# Altium project WB-AV-4510-CAN.PrjPcb (part 2 of 2)

## Sheet Temp_Sensor.SchDoc
size A4
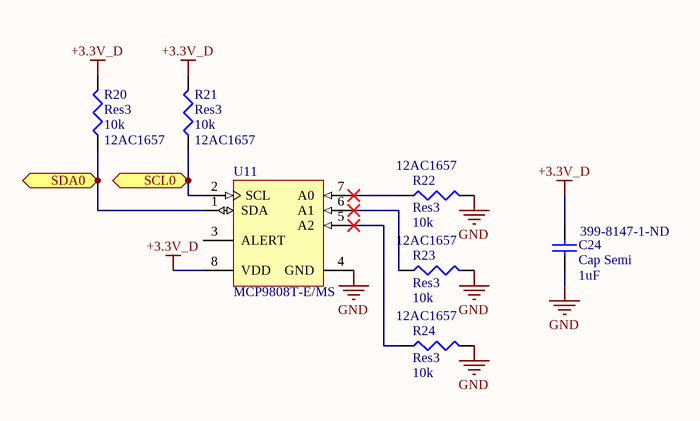
[diagram p4: Temp_Sensor.SchDoc]

### Parts
C24  Cap Semi  value 1uF  Supplier Part Number 1: 399-8147-1-ND  [C1206]
R20  Res3  value 10k  Supplier Part Number 1: 12AC1657  [6-0805_L]
R21  Res3  value 10k  Supplier Part Number 1: 12AC1657  [6-0805_L]
R22  Res3  value 10k  Supplier Part Number 1: 12AC1657  [6-0805_L]
R23  Res3  value 10k  Supplier Part Number 1: 12AC1657  [6-0805_L]
R24  Res3  value 10k  Supplier Part Number 1: 12AC1657  [6-0805_L]
U11  MCP9808T-E/MS  [MCHP-MSOP-MS8_M]

### Ports
SCL0 (bidir), SDA0 (bidir)

### Nets
+3.3V_D: C24.2 R20.2 R21.2 U11.8(VDD)
GND: C24.1 R22.2 R23.2 R24.2 U11.4(GND)  [project net AGND]
NetR20_1: R20.1 U11.1(SDA) ; port SDA0
NetR21_1: R21.1 U11.2(SCL) ; port SCL0
NetR22_1: R22.1 U11.7(A0)
NetR23_1: R23.1 U11.6(A1)
NetR24_1: R24.1 U11.5(A2)

Not connected (* = marked no-connect by the designer): U11 3(ALERT)

### Library data of the parts
C24 = Cap Semi: Multilayer Ceramic Capacitors MLCC - SMD/SMT 50volts 1uF X7R 10%; Manufacturer: KEMET; Manufacturer Part Number: C1206C105K5RACTU; SPN: 732-7692-1-ND; Voltage Rating (DC): 50V; Published: 8-Jun-2000; LatestRevisionDate: 29-May-2009; LatestRevisionNote: IPC-7351 Footprint Added.; PackageReference: C1206; Publisher: Altium Limited; PackageDescription: Chip Capacitor; Supplier 1: Digi-Key; RoHS: Yes; Category: Ceramic Capacitors; Stock 1: 155925; Pricing 1: 1=0.30000, 10=0.20900, 50=0.13940, 100=0.11850, 500=0.08364, 1000=0.07318 (USD); Mount: Surface Mount; Case/Package: 1206; Number of Pins: 2; Case Code (Imperial): 1206; Case Code (Metric): 3216; Dielectric Material: Ceramic; Min Operating Temperature: -55°C; Max Operating Temperature: 125°C; Capacitance: 1uF; Tolerance: 10%; Packaging: Tape and Reel; Dielectric: X7R; Voltage Rating: 50V; Termination: SMD/SMT; Package Quantity: 1; Voltage: 50V; Length: 3.2mm; Height: 1mm; Width: 0.063inch; Depth: 1.6mm; Thickness: 0.043inch; Radiation Hardening: No; REACH SVHC: No SVHC; ComponentLink1URL: https://datasheet.ciiva.com/7730/kem-c1002-x7r-smd-7730086.pdf?src-supplier=Element14; ComponentLink1Description: https://datasheet.ciiva.com/7730/kem-c1002-x7r-smd-7730086.pdf?src-supplier=Element14; ComponentLink2URL: https://datasheet.ciiva.com/6074/kem-c1002-x7r-smd-6074697.pdf?src-supplier=Farnell; ComponentLink2Description: https://datasheet.ciiva.com/6074/kem-c1002-x7r-smd-6074697.pdf?src-supplier=Farnell; ComponentLink3URL: https://datasheet.ciiva.com/22749/1918693-22749725.pdf?src-supplier=Element14; ComponentLink3Description: https://datasheet.ciiva.com/22749/1918693-22749725.pdf?src-supplier=Element14
R20-R24 = Res3: VISHAY BC COMPONENTS   MCT06030C1002FP500   RESISTOR, 0603, 10KOHM, 100mW, 1PER; SPN: RNCP0805FTD10K0CT-ND; Resistance: 10kR; Tolerance: 1%; Temperature Coefficient: 50ppm/°C; Voltage Rating: 75V; Max Power Dissipation: 125mW; Published: 8-Jun-2000; LatestRevisionDate: 29-May-2009; LatestRevisionNote: IPC-7351 Footprint Added.; PackageReference: J1-0603; Publisher: Altium Limited; PackageDescription: Chip Resistor; Supplier 1: Newark; Manufacturer: Vishay; Manufacturer Part Number: MCT06030C1002FP500; RoHS: Yes; Category: Chip SMD Resistors; Stock 1: 224988; Pricing 1: 1=0.02000, 5000=0.01900, 10000=0.01800, 20000=0.01700, 30000=0.01600 (USD); Mount: Surface Mount; Case/Package: 0603; Case Code (Imperial): 0603; Case Code (Metric): 1608; Contact Plating: Tin; Min Operating Temperature: -55°C; Max Operating Temperature: 125°C; Packaging: Tape and Reel; Composition: Thin Film; Power Rating: 100mW; Number of Terminations: 2; Military Standard: Not; Package Quantity: 1; Voltage Rating (DC): 75V; Length: 1.55mm; Height: 0.022inch; Width: 0.8mm; Depth: 0.85mm; Radiation Hardening: No; Lead Free: Lead Free; REACH SVHC: Unknown; ComponentLink1URL: https://datasheet.ciiva.com/7836/mc-pro-7836231.pdf?src-supplier=Element14; ComponentLink1Description: https://datasheet.ciiva.com/7836/mc-pro-7836231.pdf?src-supplier=Element14; ComponentLink2URL: https://datasheet.ciiva.com/2470/mc-pro-2470393.pdf?src-supplier=Digi-Key; ComponentLink2Description: https://datasheet.ciiva.com/2470/mc-pro-2470393.pdf?src-supplier=Digi-Key; ComponentLink3URL: https://datasheet.ciiva.com/48524/mc-pro-48524219.pdf?src-supplier=Avnet; ComponentLink3Description: https://datasheet.ciiva.com/48524/mc-pro-48524219.pdf?src-supplier=Avnet; ComponentLink4URL: https://datasheet.ciiva.com/16452/mc-pro-16452734.pdf?src-supplier=Future+Electronics; ComponentLink4Description: https://datasheet.ciiva.com/16452/mc-pro-16452734.pdf?src-supplier=Future+Electronics; ComponentLink5URL: https://datasheet.ciiva.com/22734/mc-pro-22734095.pdf?src-supplier=Element14; ComponentLink5Description: https://datasheet.ciiva.com/22734/mc-pro-22734095.pdf?src-supplier=Element14; ComponentLink6URL: https://datasheet.ciiva.com/2470/mc-pro-2470394.pdf?src-supplier=Digi-Key; ComponentLink6Description: https://datasheet.ciiva.com/2470/mc-pro-2470394.pdf?src-supplier=Digi-Key; ComponentLink7URL: https://datasheet.ciiva.com/2470/mc-pro-2470395.pdf?src-supplier=Digi-Key; ComponentLink7Description: https://datasheet.ciiva.com/2470/mc-pro-2470395.pdf?src-supplier=Digi-Key; ComponentLink8URL: https://datasheet.ciiva.com/5897/mc-pro-5897803.pdf?src-supplier=Farnell; ComponentLink8Description: https://datasheet.ciiva.com/5897/mc-pro-5897803.pdf?src-supplier=Farnell; ComponentLink9URL: https://datasheet.ciiva.com/16512/mc-pro-16512780.pdf?src-supplier=Avnet+Asia; ComponentLink9Description: https://datasheet.ciiva.com/16512/mc-pro-16512780.pdf?src-supplier=Avnet+Asia; ComponentLink10URL: https://datasheet.ciiva.com/16892/mc-pro-16892989.pdf?src-supplier=Avnet+Europe; ComponentLink10Description: https://datasheet.ciiva.com/16892/mc-pro-16892989.pdf?src-supplier=Avnet+Europe; ComponentLink11URL: https://datasheet.ciiva.com/9112/mc-pro-9112527.pdf?src-supplier=Avnet; ComponentLink11Description: https://datasheet.ciiva.com/9112/mc-pro-9112527.pdf?src-supplier=Avnet
U11 = CMP-0192-00343-1: + / - 0.5 degC Maximum Accuracy Digital Temperature Sensor, 400 uA, 2.7 to 5.5 V, -40 to 125 degC, 8-pin MSOP (MS8), Tape and Reel; Manufacturer: Microchip; PackageVersion: C04-111C; ComponentLink1URL: http://www.microchip.com; ComponentLink2URL: http://ww1.microchip.com/downloads/en/DeviceDoc/25095A.pdf; PackageReference: MSOP-MS8; ComponentLink2Description: Datasheet; DatasheetVersion: Rev. A; ComponentLink1Description: Manufacturer URL; PackageDescription: 8-Lead Plastic Micro Small Outline Package, 3 x 3 mm Body, 0.65 mm Pitch; ComponentLink3Description: Package Specification; ComponentLink3URL: http://www.microchip.com/stellent/groups/techpub_sg/documents/packagingspec/en012702.pdf; PartNumber: MCP9808T-E/MS; ComponentLink4URL: http://www.microchip.com/MCP9808; ComponentLink4Description: Product URL; Mounting Technology: Surface Mount

## Sheet Thermocouple.SchDoc
size A4
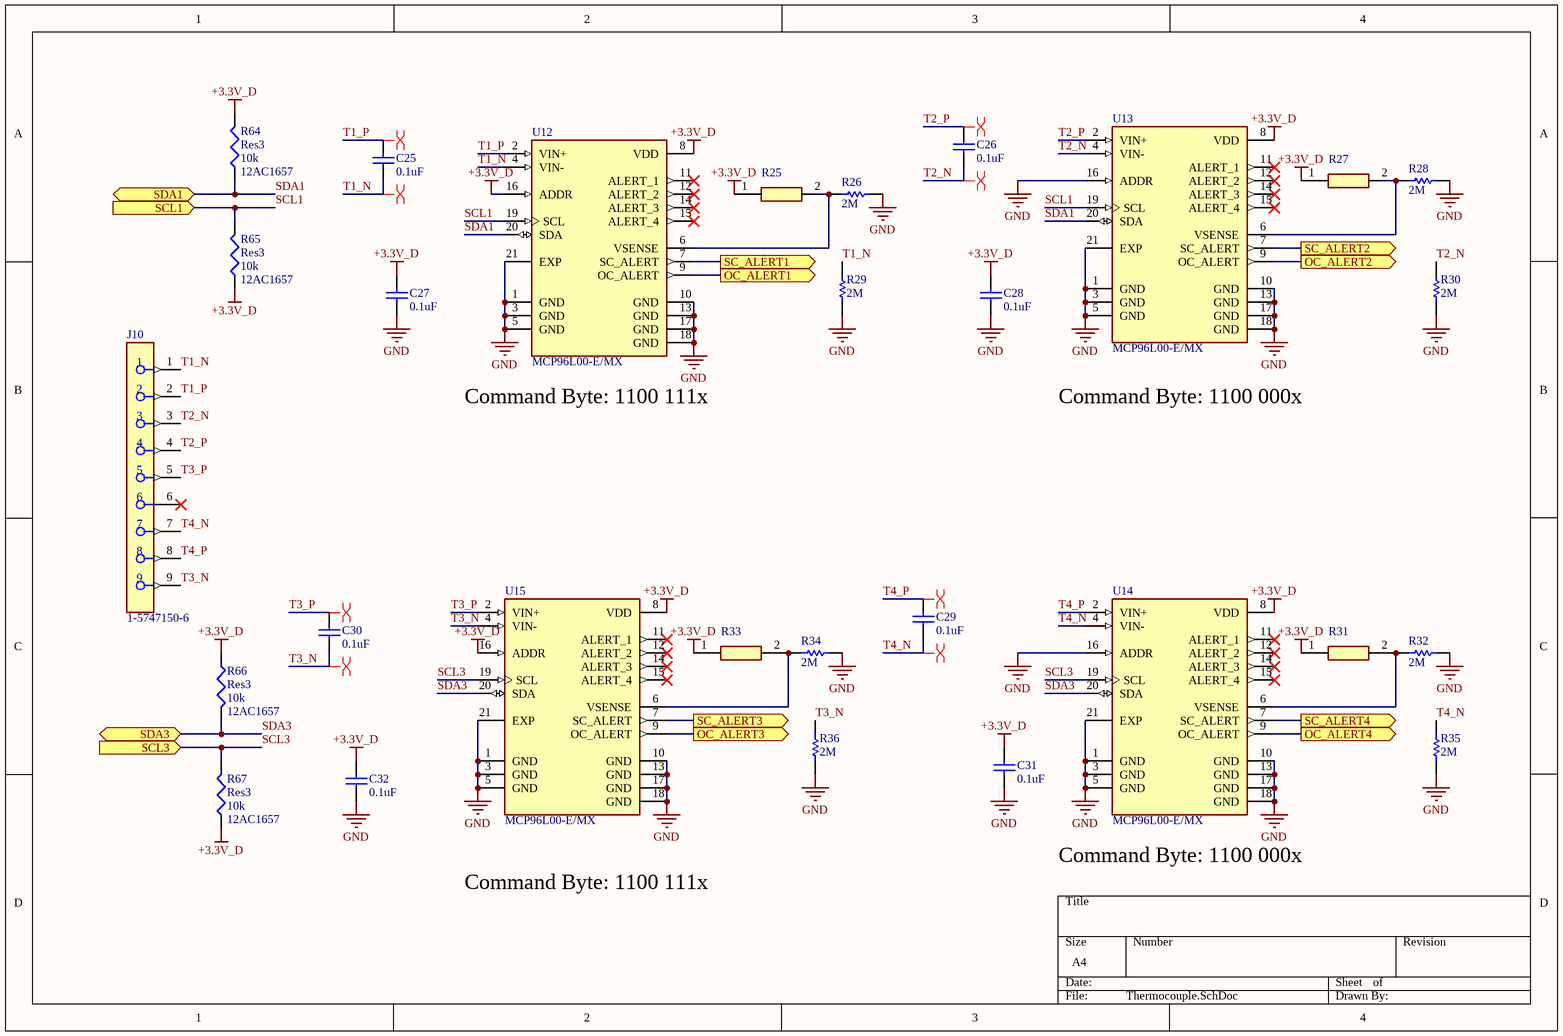
[diagram p5: Thermocouple.SchDoc]

### Parts
C25  0.1uF  [CAPC1608X90X35NL15T15]
C26  0.1uF  [CAPC1608X90X35NL15T15]
C27  0.1uF  [CAPC1608X90X35NL15T15]
C28  0.1uF  [CAPC1608X90X35NL15T15]
C29  0.1uF  [CAPC1608X90X35NL15T15]
C30  0.1uF  [CAPC1608X90X35NL15T15]
C31  0.1uF  [CAPC1608X90X35NL15T15]
C32  0.1uF  [CAPC1608X90X35NL15T15]
J10  1-5747150-6  [FP-1-5747150-6-MFG]
R25  ERJ-U02F1004X  [ERJS02_U02_(0402)]  (value not drawn)
R26  Resistance: 2M  [RESC1005X40X25LL05T05]  (hidden comment: ERJ-2GEJ205X)
R27  ERJ-U02F1004X  [ERJS02_U02_(0402)]  (value not drawn)
R28  Resistance: 2M  [RESC1005X40X25LL05T05]  (hidden comment: ERJ-2GEJ205X)
R29  Resistance: 2M  [RESC1005X40X25LL05T05]  (hidden comment: ERJ-2GEJ205X)
R30  Resistance: 2M  [RESC1005X40X25LL05T05]  (hidden comment: ERJ-2GEJ205X)
R31  ERJ-U02F1004X  [ERJS02_U02_(0402)]  (value not drawn)
R32  Resistance: 2M  [RESC1005X40X25LL05T05]  (hidden comment: ERJ-2GEJ205X)
R33  ERJ-U02F1004X  [ERJS02_U02_(0402)]  (value not drawn)
R34  Resistance: 2M  [RESC1005X40X25LL05T05]  (hidden comment: ERJ-2GEJ205X)
R35  Resistance: 2M  [RESC1005X40X25LL05T05]  (hidden comment: ERJ-2GEJ205X)
R36  Resistance: 2M  [RESC1005X40X25LL05T05]  (hidden comment: ERJ-2GEJ205X)
R64  Res3  value 10k  Supplier Part Number 1: 12AC1657  [6-0805_L]
R65  Res3  value 10k  Supplier Part Number 1: 12AC1657  [6-0805_L]
R66  Res3  value 10k  Supplier Part Number 1: 12AC1657  [6-0805_L]
R67  Res3  value 10k  Supplier Part Number 1: 12AC1657  [6-0805_L]
U12  MCP96L00-E/MX  [QFN65P500X500X100-21N_MCP9600-E/MX]
U13  MCP96L00-E/MX  [QFN65P500X500X100-21N_MCP9600-E/MX]
U14  MCP96L00-E/MX  [QFN65P500X500X100-21N_MCP9600-E/MX]
U15  MCP96L00-E/MX  [QFN65P500X500X100-21N_MCP9600-E/MX]

### Ports
OC_ALERT1 (out), OC_ALERT2 (out), OC_ALERT3 (out), OC_ALERT4 (out), SC_ALERT1 (out), SC_ALERT2 (out), SC_ALERT3 (out), SC_ALERT4 (out), SCL1 (in), SCL3 (in), SDA1 (bidir), SDA3 (bidir)

### Nets
+3.3V_D: C27.2 C28.2 C31.2 C32.2 R25.1 R27.1 R31.1 R33.1 R64.2 R65.1 R66.1 R67.1 U12.8(VDD) U12.16(ADDR) U13.8(VDD) U14.8(VDD) U15.8(VDD) U15.16(ADDR)
GND: C27.1 C28.1 C31.1 C32.1 R26.2 R28.2 R29.1 R30.1 R32.2 R34.2 R35.1 R36.1 U12.1(GND) U12.3(GND) U12.5(GND) U12.10(GND) U12.13(GND) U12.17(GND) U12.18(GND) U12.21(EXP) U13.1(GND) U13.3(GND) U13.5(GND) U13.10(GND) U13.13(GND) U13.16(ADDR) U13.17(GND) U13.18(GND) U13.21(EXP) U14.1(GND) U14.3(GND) U14.5(GND) U14.10(GND) U14.13(GND) U14.16(ADDR) U14.17(GND) U14.18(GND) U14.21(EXP) U15.1(GND) U15.3(GND) U15.5(GND) U15.10(GND) U15.13(GND) U15.17(GND) U15.18(GND) U15.21(EXP)  [project net AGND]
SCL1: R65.2 U12.19(SCL) U13.19(SCL) ; port SCL1
SCL3: R67.2 U14.19(SCL) U15.19(SCL) ; port SCL3
SDA1: R64.1 U12.20(SDA) U13.20(SDA) ; port SDA1
SDA3: R66.2 U14.20(SDA) U15.20(SDA) ; port SDA3
T1_N: C25.1 J10.1 R29.2 U12.4(VIN-)
T1_P: C25.2 J10.2 U12.2(VIN+)
T2_N: C26.1 J10.3 R30.2 U13.4(VIN-)
T2_P: C26.2 J10.4 U13.2(VIN+)
T3_N: C30.1 J10.9 R36.2 U15.4(VIN-)
T3_P: C30.2 J10.5 U15.2(VIN+)
T4_N: C29.1 J10.7 R35.2 U14.4(VIN-)
T4_P: C29.2 J10.8 U14.2(VIN+)
NetR25_2: R25.2 R26.1 U12.6(VSENSE)
NetR27_2: R27.2 R28.1 U13.6(VSENSE)
NetR31_2: R31.2 R32.1 U14.6(VSENSE)
NetR33_2: R33.2 R34.1 U15.6(VSENSE)
NetU4_123: U15.9(OC_ALERT) ; port OC_ALERT3
NetU4_124: U15.7(SC_ALERT) ; port SC_ALERT3
NetU4_125: U13.9(OC_ALERT) ; port OC_ALERT2
NetU4_126: U13.7(SC_ALERT) ; port SC_ALERT2
NetU4_127: U12.9(OC_ALERT) ; port OC_ALERT1
NetU4_128: U12.7(SC_ALERT) ; port SC_ALERT1
NetU4_129: U14.9(OC_ALERT) ; port OC_ALERT4
NetU4_130: U14.7(SC_ALERT) ; port SC_ALERT4

Not connected (* = marked no-connect by the designer): J10 6*; U12 11(ALERT_1)* 12(ALERT_2)* 14(ALERT_3)* 15(ALERT_4)*; U13 11(ALERT_1)* 12(ALERT_2)* 14(ALERT_3)* 15(ALERT_4)*; U14 11(ALERT_1)* 12(ALERT_2)* 14(ALERT_3)* 15(ALERT_4)*; U15 11(ALERT_1)* 12(ALERT_2)* 14(ALERT_3)* 15(ALERT_4)*

### Layout directives
differential pair: T1_N, T1_P, T2_N, T2_P, T3_N, T3_P, T4_N, T4_P

### Notes on the sheet
- (near U12) Command Byte: 1100 111x
- Command Byte: 1100 000x
- Command Byte: 1100 111x
- (near U14) Command Byte: 1100 000x

### Library data of the parts
C25-C32 = CMP-2006-04489-1: Part Number: 0603YC104JAT2A; Manufacturer: AVX Interconnect / Elco
J10 = CMP-03367-000009-1: CONN D-SUB RCPT 9POS VERT SOLDER; Manufacturer: TE Connectivity; Is Female: yes; Current Rating: 6A; Conn Orientation: Vertical; Conn Gender: Female; Shielding: false; Number Of Contacts: 9; Pitch: 2.74mm; ComponentLink2URL: https://www.te.com/usa-en/product-1-5747150-6.html?te_bu=Cor&te_type=other&te_campaign=oct_glo_cor-oct-global-oth-prtnr-fy19-oct-octo-buy-bom_sma-298_2&elqCampaignId=35216; Manufacturer Part Number: 1-5747150-6; Temperature: -55°C to +105°C; Mouser Description: D-Sub Standard Connectors RECP FRNT MTL SHL 9P female screwlocks; Octopart: https://octopart.com/1-5747150-6-te+connectivity-39500344; Category: Conn; Automotive: No; Package: 1-5747150-6; Device Class L3: unset; Contact Material: Gold,Nickel; Lead Free: Yes; Height: 12.54mm; RoHS: TRUE; ComponentLink2Description: Datasheet; Device Class L2: D-Sub Connectors; Device Class L1: Connectors; Digikey Description: CONN D-SUB RCPT 9POS VERT SOLDER; Temperature Range High: +105°C; Temperature Range Low: -55°C
R25 R27 R31 R33 = ERJ-U02F1004X: Resistor; Manufacturer_Name: Panasonic; Datasheet Link: https://industrial.panasonic.com/cdbs/www-data/pdf/RDP0000/AOA0000C334.pdf; Height: 0.4mm; Manufacturer_Part_Number: ERJ-U02F1004X
R26 R28-R30 R32 R34-R36 = CMP-1011-00153-2: Manufacturer: Panasonic; Part Number: ERJ-2GEJ205X
R64-R67 = Res3: as R20 on sheet Temp_Sensor; Published: 8-Jun-2000; LatestRevisionDate: 29-May-2009; LatestRevisionNote: IPC-7351 Footprint Added.; PackageReference: J1-0603; Publisher: Altium Limited; PackageDescription: Chip Resistor; Supplier 1: Newark; Manufacturer: Vishay; Manufacturer Part Number: MCT06030C1002FP500; RoHS: Yes; Category: Chip SMD Resistors; Stock 1: 224988; Pricing 1: 1=0.02000, 5000=0.01900, 10000=0.01800, 20000=0.01700, 30000=0.01600 (USD); Mount: Surface Mount; Case/Package: 0603; Case Code (Imperial): 0603; Case Code (Metric): 1608; Contact Plating: Tin; Min Operating Temperature: -55°C; Max Operating Temperature: 125°C; Packaging: Tape and Reel; Composition: Thin Film; Power Rating: 100mW; Number of Terminations: 2; Military Standard: Not; Package Quantity: 1; Voltage Rating (DC): 75V; Length: 1.55mm; Height: 0.022inch; Width: 0.8mm; Depth: 0.85mm; Radiation Hardening: No; Lead Free: Lead Free; REACH SVHC: Unknown; ComponentLink1URL: https://datasheet.ciiva.com/7836/mc-pro-7836231.pdf?src-supplier=Element14; ComponentLink1Description: https://datasheet.ciiva.com/7836/mc-pro-7836231.pdf?src-supplier=Element14; ComponentLink2URL: https://datasheet.ciiva.com/2470/mc-pro-2470393.pdf?src-supplier=Digi-Key; ComponentLink2Description: https://datasheet.ciiva.com/2470/mc-pro-2470393.pdf?src-supplier=Digi-Key; ComponentLink3URL: https://datasheet.ciiva.com/48524/mc-pro-48524219.pdf?src-supplier=Avnet; ComponentLink3Description: https://datasheet.ciiva.com/48524/mc-pro-48524219.pdf?src-supplier=Avnet; ComponentLink4URL: https://datasheet.ciiva.com/16452/mc-pro-16452734.pdf?src-supplier=Future+Electronics; ComponentLink4Description: https://datasheet.ciiva.com/16452/mc-pro-16452734.pdf?src-supplier=Future+Electronics; ComponentLink5URL: https://datasheet.ciiva.com/22734/mc-pro-22734095.pdf?src-supplier=Element14; ComponentLink5Description: https://datasheet.ciiva.com/22734/mc-pro-22734095.pdf?src-supplier=Element14; ComponentLink6URL: https://datasheet.ciiva.com/2470/mc-pro-2470394.pdf?src-supplier=Digi-Key; ComponentLink6Description: https://datasheet.ciiva.com/2470/mc-pro-2470394.pdf?src-supplier=Digi-Key; ComponentLink7URL: https://datasheet.ciiva.com/2470/mc-pro-2470395.pdf?src-supplier=Digi-Key; ComponentLink7Description: https://datasheet.ciiva.com/2470/mc-pro-2470395.pdf?src-supplier=Digi-Key; ComponentLink8URL: https://datasheet.ciiva.com/5897/mc-pro-5897803.pdf?src-supplier=Farnell; ComponentLink8Description: https://datasheet.ciiva.com/5897/mc-pro-5897803.pdf?src-supplier=Farnell; ComponentLink9URL: https://datasheet.ciiva.com/16512/mc-pro-16512780.pdf?src-supplier=Avnet+Asia; ComponentLink9Description: https://datasheet.ciiva.com/16512/mc-pro-16512780.pdf?src-supplier=Avnet+Asia; ComponentLink10URL: https://datasheet.ciiva.com/16892/mc-pro-16892989.pdf?src-supplier=Avnet+Europe; ComponentLink10Description: https://datasheet.ciiva.com/16892/mc-pro-16892989.pdf?src-supplier=Avnet+Europe; ComponentLink11URL: https://datasheet.ciiva.com/9112/mc-pro-9112527.pdf?src-supplier=Avnet; ComponentLink11Description: https://datasheet.ciiva.com/9112/mc-pro-9112527.pdf?src-supplier=Avnet
U12-U15 = MCP96001-E/MX: IC THERMOCOUPLE TO I2C 20MQFN; MF: Microchip; Package: VQFN-20 Microchip; MP: MCP96L00-E/MX; Value: *; Availability: Unavailable; SnapEDA_Link: https://www.snapeda.com/parts/MCP9600-E/MX/Microchip/view-part/553302/?ref=snap; Price: None

## Sheet Power.SchDoc
size A4
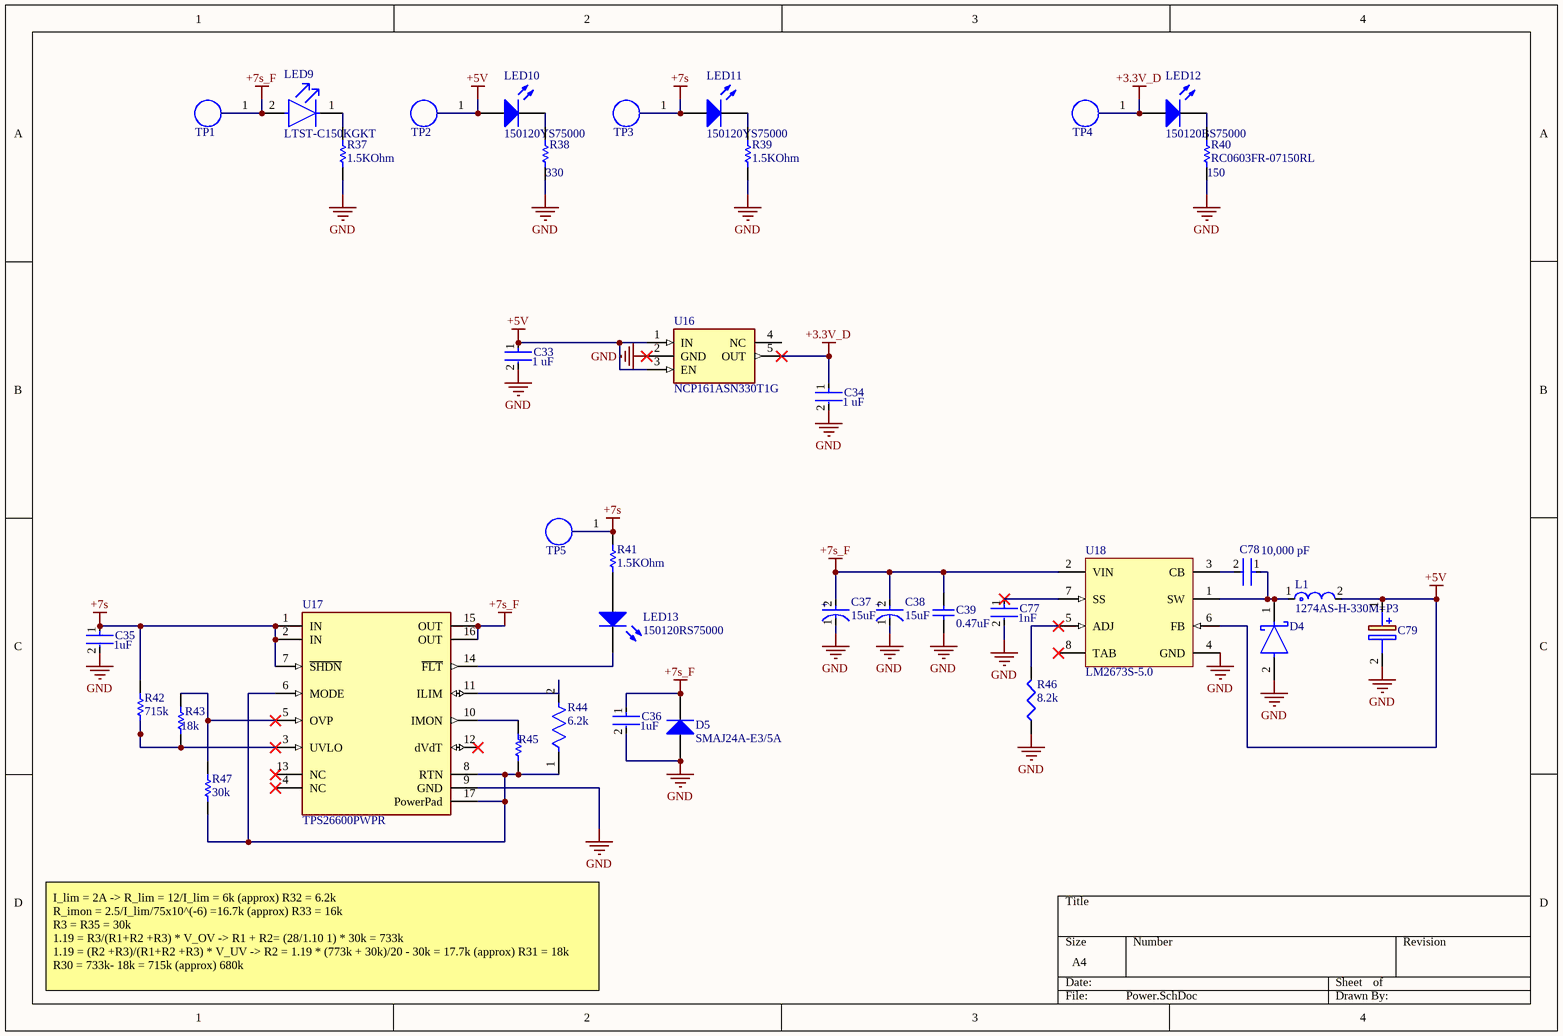
[diagram p6: Power.SchDoc]

### Parts
C33  Capacitance: 1 uF  [FP-CC0402-MFG]  (hidden comment: CC0402KRX5R5BB105)
C34  Capacitance: 1 uF  [FP-CC0402-MFG]  (hidden comment: CC0402KRX5R5BB105)
C35  Capacitance: 1uF  [FP-CGA4J-IPC_C]  (hidden comment: CGA4J3X7S2A105M125AE)
C36  Capacitance: 1uF  [FP-CGA4J-IPC_C]  (hidden comment: CGA4J3X7S2A105M125AE)
C37  value 15uF  [FP-TPSE-MFG]  (hidden comment: TPSE156M050R0250)
C38  value 15uF  [FP-TPSE-MFG]  (hidden comment: TPSE156M050R0250)
C39  Parameter 1: 0.47uF  [CAPC2013X140X50ML20T25]  (hidden comment: C0805F474K3RACTU)
C77  Capacitance: 1nF  [FP-CL10-IPC_C]  (hidden comment: CL10B102KB8NNNC)
C78  value 10,000 pF  [FP-C0805C-DN-MFG]  (hidden comment: C0805C103J5RACTU)
C79  16SVPS180M  [10SVPS150M]  (value not drawn)
D4  PMEG4030ER,115  [FP-SOD123W-MFG]  (value not drawn)
D5  SMAJ24A-E3/5A  [VISH-DO-214AC-2_M]
L1  1274AS-H-330M=P3  [FP-DEM10050C-MFG]
LED9  LTST-C150KGKT  [FP-LTST-C150KGKT-MFG]
LED10  150120YS75000  [1206_A]
LED11  150120YS75000  [1206_A]
LED12  150120BS75000  [1206_A]
LED13  150120RS75000  [1206_A]
R37  Resistance: 1.5KOhm  [RESC1608X55X25ML10T15]  (hidden comment: RC0603FR-071K5L)
R38  value 330  [RESC1608X55X30NL15T15]  (hidden comment: ERJ3EKF3300V)
R39  Resistance: 1.5KOhm  [RESC1608X55X25ML10T15]  (hidden comment: RC0603FR-071K5L)
R40  RC0603FR-07150RL  value 150  [RESC1608X55X25ML10T15]
R41  Resistance: 1.5KOhm  [RESC1608X55X25ML10T15]  (hidden comment: RC0603FR-071K5L)
R42  value 715k  [RESC1608X55X30ML20T10]  (hidden comment: RK73H1JTTD7153F)
R43  value 18k  [RESC1608X55X30LL15T15]  (hidden comment: ERJ3EKF1802V)
R44  Resistance: 6.2k  [FP-RMCF0603-MFG]  (hidden comment: RMCF0603JT6K20)
R45  ERA-3AEB163V  [RESC1608X55X30NL20T20]  (value not drawn)
R46  value 8.2k  [J1-0603]  (hidden comment: Res3)
R47  value 30k  [RESC1608X55X30ML20T10]  (hidden comment: RK73H1JTTD3002F)
TP1  TP_1  [TestPoint]  (value not drawn)  (no BOM)
TP2  TP_1  [TestPoint]  (value not drawn)  (no BOM)
TP3  TP_1  [TestPoint]  (value not drawn)  (no BOM)
TP4  TP_1  [TestPoint]  (value not drawn)  (no BOM)
TP5  TP_1  [TestPoint]  (value not drawn)  (no BOM)
U16  NCP161ASN330T1G  [SOT95P280X145-5N]
U17  TPS26600PWPR  [FP-PWP0016H-MFG]
U18  LM2673S-5.0  [KTW0007B_N]

### Nets
+3.3V_D: C34.1 LED12.2(A) TP4.1 U16.5(OUT)
+5V: C33.1 C79.1(+) L1.2 LED10.2(A) TP2.1 U16.1(IN) U16.3(EN) U18.6(FB)
+7s: C35.1 LED11.2(A) R41.2 R42.2 TP3.1 TP5.1 U17.1(IN) U17.2(IN) U17.7(~{SHDN})
+7s_F: C36.1 C37.2(A) C38.2(A) C39.1 D5.1(K) LED9.2(A) TP1.1 U17.15(OUT) U17.16(OUT) U18.2(VIN)
GND: C33.2 C34.2 C35.2 C36.2 C37.1(C) C38.1(C) C39.2 C77.2 C79.2(-) D4.2(A) D5.2(A) R37.1 R38.1 R39.1 R40.1 R46.1 U16.2(GND) U17.9(GND) U18.4(GND)  [project net AGND]
NetC77_1: C77.1 U18.7(SS)
NetC78_1: C78.1 D4.1(C) L1.1 U18.1(SW)
NetC78_2: C78.2 U18.3(CB)
NetLED9_1: LED9.1(C) R37.2
NetLED10_1: LED10.1(K) R38.2
NetLED11_1: LED11.1(K) R39.2
NetLED12_1: LED12.1(K) R40.2
NetLED13_1: LED13.1(K) U17.14(~{FLT})
NetLED13_2: LED13.2(A) R41.1
NetR42_1: R42.1 R43.1 U17.3(UVLO)
NetR43_2: R43.2 R47.2 U17.5(OVP)
NetR44_1: R44.1 R45.1 R47.1 U17.6(MODE) U17.8(RTN) U17.17(PowerPad)
NetR44_2: R44.2 U17.11(ILIM)
NetR45_2: R45.2 U17.10(IMON)
NetR46_2: R46.2 U18.5(ADJ)

Not connected (* = marked no-connect by the designer): U16 4(NC); U17 4(NC)* 12(dVdT)* 13(NC)*; U18 8(TAB)*

### Notes on the sheet
- I_lim = 2A -> R_lim = 12/I_lim = 6k (approx) R32 = 6.2k
  R_imon = 2.5/I_lim/75x10^(-6) =16.7k (approx) R33 = 16k
  R3 = R35 = 30k
  1.19 = R3/(R1+R2 +R3) * V_OV -> R1 + R2= (28/1.10 1) * 30k = 733k
  1.19 = (R2 +R3)/(R1+R2 +R3) * V_UV -> R2 = 1.19 * (773k + 30k)/20 - 30k = 17.7k (approx) R31 = 18k
  R30 = 733k- 18k = 715k (approx) 680k
- (in symbol CMP-04424-000028-1) +

### Library data of the parts
C33 C34 = CMP-2100-03591-2: CAP CER 1UF 6.3V X5R 0402; Manufacturer: YAGEO; Automotive Grade: NA; Material: Ceramic; Tolerance: 0.1; Temperature Coefficient: 30ppm/°C; Voltage Rating: 6.3 V; Temperature Range Low: -55°C; Digikey Description: CAP CER 1UF 6.3V X5R 0402; Height: 0.55mm; Automotive: No; ComponentLink2URL: http://www.yageo.com/documents/recent/UPY-GP_NP0_16V-to-50V_16.pdf; Device Class L2: Capacitors; RoHS: TRUE; Temperature Range High: +125°C; Device Class L3: Ceramic Capacitors; Device Class L1: Passive Components; Temperature Characteristic: X5R; Package: CC0402; Octopart: https://octopart.com/cc0402krx5r5bb105-yageo-42244618; ComponentLink2Description: Datasheet; Temperature: -55°C to +125°C; Manufacturer Part Number: CC0402KRX5R5BB105; Mouser Description: Multilayer Ceramic Capacitors MLCC - SMD/SMT 1uF 6.3V X5R 10%; Category: Cap; Footprint Url: http://www.yageo.com/exep/pages/download/literatures/UPY-C_GEN_24.pdf; Lead Free: Yes; Ipc Land Pattern Name: CAPC10050X50; Value: 1 uF
C35 C36 = CMP-08246-000293-1: Cap Ceramic 1uF 100V X7S 20% Pad SMD 0805 +125°C Automotive T/R; Width: 1.2mm; Height: 1.25mm; Max Operating Temperature: 125°C; Case/Package: 0805; Tolerance: 20%; Termination: SMD/SMT; Lead Free: Lead Free; Mount: Surface Mount; Radiation Hardening: No; Depth: 1.25mm; Ratings: AEC-Q200; Case Code (Metric): 2012; Length: 2mm; Thickness: 0.049inch; REACH SVHC: No SVHC; Weight: 0.000194oz; Packaging: Tape and Reel; Case Code (Imperial): 0805; Dielectric: X7S; Features: Soft Termination; Voltage Rating (DC): 100V; Voltage Rating: 100V; Package Quantity: 1; Min Operating Temperature: -55°C
C37 C38 = CMP-04424-000028-1: CAP TANT 15UF 20% 50V 2917; Manufacturer: AVX Corporation; Ripple Current: 0.812A; Esr: 250mΩ; Leakage Current: 7.5uA; Dissipation Factor: 6%; Material: Tantalum Mn02 solid electrolyte; Life: 1000Hours; Device Class L2: Capacitors; Lead Free: Yes; Temperature Range High: +125°C; ComponentLink2Description: Datasheet; Height: 4.3mm; Temperature: -55°C to +125°C; Octopart: https://octopart.com/tpse156m050r0250-avx-7476984; Mouser Description: Tantalum Capacitors - Solid SMD 15uF 20% 50Volts; Device Class L1: Passive Components; Category: Cap; Digikey Description: CAP TANT 15UF 20% 50V 2917; RoHS: TRUE; Temperature Range Low: -55°C; Voltage Rating: 50V; Capacitance: 15uF; Tolerance: 20%; Automotive: No; Package: TPSE; ComponentLink2URL: http://datasheets.avx.com/TPS.pdf; Device Class L3: Tantalum Capacitors; Manufacturer Part Number: TPSE156M050R0250; Footprint Url: https://www.avx.com/download/software/literature/AVX-Footprint-Library.pdf
C39 = CMP-2007-03309-1: Manufacturer: Kemet; Part Number: C0805F474K3RACTU
C77 = CMP-2000-06091-2: Cap Ceramic 1nF 50V X7R ±10% Pad SMD 0603 +125°C T/R; Radiation Hardening: No; Length: 1.6mm; Voltage Rating: 50V; Case Code (Imperial): 0603; Case Code (Metric): 1608; Max Operating Temperature: 125°C; Thickness: 0.035inch; Voltage Rating (DC): 50V; Contact Plating: Tin; Width: 0.031inch; Mount: Surface Mount; Lead Free: Lead Free; Voltage: 50V; Material: Ceramic; Package Quantity: 1; Dielectric: X7R; Case/Package: 0603; Height: 0.8mm; Min Operating Temperature: -55°C; Tolerance: 10%; Depth: 0.8mm; Packaging: Tape and Reel
C78 = CMP-2007-00254-2: CAP CER 10000PF 50V X7R 0805; Manufacturer: KEMET; Material: Ceramic; Temperature Coefficient: 30ppm/°C; Tolerance: 0.05; Device Class L1: Passive Components; Temperature: -55°C to +125°C; Lead Free: Yes; ComponentLink2URL: https://content.kemet.com/datasheets/KEM_C1003_C0G_SMD.pdf; Device Class L3: Ceramic Capacitors; Temperature Characteristic: X7R; Temperature Range High: +125°C; Mouser Description: Capacitor; Ceramic; Cap 0.01uF; Tol 5%; Vol-Rtg 50 V; SMT; Case 0805; X7R; TR; ComponentLink2Description: Datasheet; Manufacturer Part Number: C0805C103J5RACTU; Height: 0.88mm; Digikey Description: CAP CER 10000PF 50V X7R 0805; Capacitance: 10,000 pF; Temperature Range Low: -55°C; Device Class L2: Capacitors; Octopart: https://octopart.com/c0805c103j5ractu-kemet-133473; Voltage Rating: 50 V; Category: Cap; RoHS: TRUE; Automotive: No; Package: C0805C-DN; Ipc Land Pattern Name: CAPC200125X78
C79 = 16SVPS180M: Capacitor Polarised; Manufacturer_Name: Panasonic; Datasheet Link: http://industrial.panasonic.com/cdbs/www-data/pdf/AAB8000/AAB8000C232.pdf; Height: 8mm; Manufacturer_Part_Number: 16SVPS180M
D4 = CMP-14398-000026-1: DIODE SCHOTTKY 40V 3A SOD123W; RoHS Compliant: Yes
D5 = CMP-0548-00313-2: Transient Voltage Suppressor, 6.40 to 231 V, 24 V Stand-off Voltage, Uni-Directional, -55 to 155 degC, 2-pin DO-214AC, Pb-Free, Tape and Reel; Manufacturer: Vishay Semiconductor; ID (uA): 1; VBR Uni-Directional (V): 6.4 to 231; IFSM: 40 A; VWM (V): 24; PPPM (W): 400, 300; Operating Junction and Storage Temperature Range: -55 to 150 degC; ComponentLink2URL: http://www.vishay.com/docs/88390/smaj50a.pdf; ComponentLink3Description: Package Specification; DatasheetVersion: 12/8/2013; PackageDescription: 2-Pin DO-214AC (SMA), Body 4.245 x 2.665 mm; PackageReference: DO-214AC-2; RoHS: TRUE; Mounting Technology: Surface Mount; Packing: Tape and Reel; ComponentLink1Description: Manufacturer URL; ComponentLink3URL: http://www.vishay.com/docs/88390/smaj50a.pdf; ComponentLink1URL: http://www.vishay.com/; ComponentLink2Description: Datasheet; PartNumber: SMAJ24A-E3/5A
L1 = CMP-06042-015462-1: Shielded Wirewound Inductor 33uH 20% 2500mA 0.0936Ω SMD; Saturation Current: 3.5A; Core Material: Ferrite; Current Rating: 2.5A; Test Frequency: 100kHz; DC Resistance (DCR): 93.6mR; Inductance: 33uH; Mount: Surface Mount; Height - Seated (Max): 0.197inch; Length: 0.394inch; Shielding: Shielded; Resistor Type: Wirewound; Case/Package: SMD/SMT; Max DC Current: 2.5A; Width: 0.394inch; Number of Pins: 2; Tolerance: 20%; Packaging: Tape and Reel
LED9 = CMP-22017-000010-1: LED GREEN CLEAR 1206 SMD; Power Dissipation: 75mW; Number of LEDs: 1; Reverse Voltage: 5V; Lens Style: Diffused; Test Current: 20mA; Forward Current: 30mA; Luminous Intensity: 71mcd; Dominant Wavelength: 571nm; Lens Color: Colorless; Viewing Angle: 130°; Forward Voltage: 2V; Wavelength: 574nm; Length: 3.2mm; Case Code (Imperial): 1206; Illumination Color: Green; Number of Pins: 2; Case Code (Metric): 3216; Package Quantity: 1; Height: 1.1mm; Power Rating: 75mW; Color: Green; Lead Free: Lead Free; Mount: Surface Mount; Radiation Hardening: No; Max Operating Temperature: 85°C; Depth: 1.6mm; Case/Package: 1206; Number of Elements: 1; Lens Transparency: Clear; Min Operating Temperature: -55°C; Packaging: Tape and Reel; Width: 1.6mm
LED10 LED11 = CMP-1426-00019-1: SMD mono-color Chip LED, WL-SMCW, Yellow; Manufacturer: Wuerth Elektronik; ComponentLink2URL: http://katalog.we-online.com/led/datasheet/150120YS75000.pdf; PartNumber: 150120YS75000; ComponentLink1URL: http://www.we-online.com; Color: Yellow; ComponentLink1Description: Manufacturer URL; PackageReference: 1206_A; ComponentLink2Description: Datasheet
LED12 = CMP-1426-00015-1: SMD mono-color Chip LED, WL-SMCW, Blue; Manufacturer: Wuerth Elektronik; ComponentLink2Description: Datasheet; ComponentLink1URL: http://www.we-online.com; PartNumber: 150120BS75000; ComponentLink1Description: Manufacturer URL; ComponentLink2URL: http://katalog.we-online.com/led/datasheet/150120BS75000.pdf; PackageReference: 1206_A; Color: Blue
LED13 = CMP-1426-00013-1: SMD mono-color Chip LED, WL-SMCW, Red; Manufacturer: Wuerth Elektronik; Color: Red; ComponentLink2URL: http://katalog.we-online.com/led/datasheet/150120RS75000.pdf; ComponentLink2Description: Datasheet; ComponentLink1Description: Manufacturer URL; ComponentLink1URL: http://www.we-online.com; PartNumber: 150120RS75000; PackageReference: 1206_A
R37 R39 R41 = CMP-2100-03665-1: Chip Resistor, 1.5 KOhm, +/- 1%, 0.1 W, -55 to 155 degC, 0603 (1608 Metric), RoHS, Tape and Reel; Manufacturer: Yageo; Power Rating: 100mW; Voltage Rating: 50V; Temperature Coefficient: 100ppm/degreesC; Military Standard: Not; Datasheet URL: http://www.yageo.com/NewPortal/yageodocoutput?fileName=/pdf/R-Chip/PYu-RC_Group_51_RoHS_L_5.pdf; Package Description: 2-Pin Surface Mount Device, Body 1.6 x 0.8 mm; Composition: ThickFilm; Case Code (Metric): 1608; Case/Package: 0603; Number of Terminations: 2; Depth: 0.8mm; Height: 0.022inch; Manufacturer URL: http://www.yageo.com/; Lead Free: LeadFree; Min Operating Temperature: -55degC; Max Operating Temperature: 155degC; Datasheet Version: Rev. 5, 10/2016; RoHSCompliant: true; Max Power Dissipation: 100mW; Packaging: TapeandReel; Voltage Rating (DC): 50V; Length: 0.063inch; Tolerance: 1%; Width: 0.031inch; Number of Pins: 2; Termination: SMD/SMT; Package Reference: 0603; Package Quantity: 1; Case Code (Imperial): 0603; REACH SVHC: NoSVHC
R38 = CMP-2000-00435-1: Manufacturer: Panasonic; Part Number: ERJ3EKF3300V
R40 = CMP-1659-00057-1: Chip Resistor, 150 Ohm, +/- 1%, 0.1 W, -55 to 155 degC, 0603 (1608 Metric), RoHS, Tape and Reel; Viewing Angle: 20 degrees; Luminous Intensity: 200 mcd; Case\Package: Radial; Lens Style: Clear; Nominal Vf: 2.2 V; Illumination Colour: Green; PackageReference: 0603; PackageDescription: 2-Pin Surface Mount Device, Body 1.6 x 0.8 mm; Package Quantity: 1000; Packaging: Bulk; DatasheetVersion: Rev. 4, 02/2016; ComponentLink2URL: http://www.yageo.com/documents/recent/PYu-RC_Group_51_RoHS_L_04.pdf; ComponentLink1Description: Manufacturer URL; Height: 8.6 mm; ComponentLink2Description: Datasheet; Mount: Through Hole; Colour: Green; RoHSCompliant: true; ComponentLink1URL: http://www.yageo.com/; Forward Voltage: 2.2 V
R42 = CMP-2000-01662-1: Manufacturer: KOA Speer; Part Number: RK73H1JTTD7153F
R43 = CMP-2000-00295-1: Manufacturer: Panasonic; Part Number: ERJ3EKF1802V
R44 = CMP-26527-001015-1: 6.2kΩ ±5% 0.1W 0603 Thick Film Chip Resistor AEC-Q200 compliant; Max Power Dissipation: 100mW; Temperature Coefficient: 200ppm/°C; Radiation Hardening: No; Length: 0.061inch; Contact Plating: Tin; Case/Package: 0603; Max Operating Temperature: 155°C; Resistor Type: Thick Film; Case Code (Imperial): 0603; Mount: Surface Mount; Power Rating: 100mW; Min Operating Temperature: -55°C; Case Code (Metric): 1608; Height: 0.022inch; Features: Automotive AEC-Q200; Lead Free: Lead Free; Series: RMCF; Number of Terminations: 2; Size Code: 0603; Width: 0.031inch; Tolerance: 5%; Packaging: Tape and Reel
R45 = CMP-2000-00925-1: Manufacturer: Panasonic; Part Number: ERA-3AEB163V
R46 = Res3: Resistor; Published: 8-Jun-2000; LatestRevisionDate: 29-May-2009; LatestRevisionNote: IPC-7351 Footprint Added.; PackageReference: J1-0603; Publisher: Altium Limited; PackageDescription: Chip Resistor; Supplier 1: Newark; Supplier Part Number 1: 41R4701
R47 = CMP-2000-01398-1: Manufacturer: KOA Speer; Part Number: RK73H1JTTD3002F
TP1-TP5 = TestPoint
U16 = NCP161ASN330T1G: Power Supply; Manufacturer_Name: ON Semiconductor; Datasheet Link: https://componentsearchengine.com/Datasheets/2/NCP161ASN330T1G.pdf; Height: 1.45mm; Manufacturer_Part_Number: NCP161ASN330T1G; Mouser Part Number: 863-NCP161ASN330T1G; Mouser Price/Stock: https://www.mouser.co.uk/ProductDetail/onsemi/NCP161ASN330T1G?qs=vLWxofP3U2ze5zA%252BHmAd3w%3D%3D; Arrow Part Number: NCP161ASN330T1G; Arrow Price/Stock: https://www.arrow.com/en/products/ncp161asn330t1g/on-semiconductor
U17 = CMP-04910-000010-1: IC PWR MGMT EFUSE 60V 16HTSSOP; Manufacturer: Texas Instruments; Number Of Outputs: 1; Nominal Supply Current: 300uA; Min Supply Voltage: 4.2V; Max Junction Temp: +125°C; Standoff Height: 0.05mm; Output Voltage: 2.7V; Device Class L1: Integrated Circuits (ICs); RoHS: TRUE; ComponentLink2Description: Datasheet; Temperature Range Low: -40°C; Max Supply Voltage: 60V; Category: IC; Mouser Description: 60V 2A Industrial eFuse With Integrated Reverse-Input Polarity Protection 16-HTSSOP -40 to 125; Ipc Land Pattern Name: SOP65P640X120-16; Temperature Range High: +125°C; Height: 1.2mm; Package: PWP0016H; Automotive: No; Device Class L2: Power Management ICs; Octopart: https://octopart.com/tps26600pwpr-texas+instruments-75302671; Digikey Description: IC PWR MGMT EFUSE 60V 16HTSSOP; Temperature: -40°C to +125°C; ComponentLink2URL: http://www.ti.com/general/docs/suppproductinfo.tsp?distId=10&gotoUrl=http%3A%2F%2Fwww.ti.com%2Flit%2Fgpn%2Ftps2660; Device Class L3: unset; Lead Free: Yes; Manufacturer Part Number: TPS26600PWPR
U18 = CMP-0069-00173-3: 3A Step-Down Voltage Regulator with Adjustable Current Limit, 7-pin TO-263; Manufacturer: Texas Instruments; PackageTopMarking: NSUZXYTTE#*LM2673*S-5.0; PowerWise: N; CompType: Switcher; PackageDescription: TO-263, Molded, .400 x .390 x .180in Body, 7 Lead, .050in Pitch, Surface Mount; ComponentLink1Description: Datasheet URL; RoHS: N; Code_JEDEC: MO-169-AC; PackageReference: KTW0007B; ComponentLink1URL: http://www.ti.com/general/docs/lit/getliterature.tsp?genericPartNumber=LM2673&fileType=pdf; PinCount: 7

## Sheet 24V Regulators.SchDoc
size A3
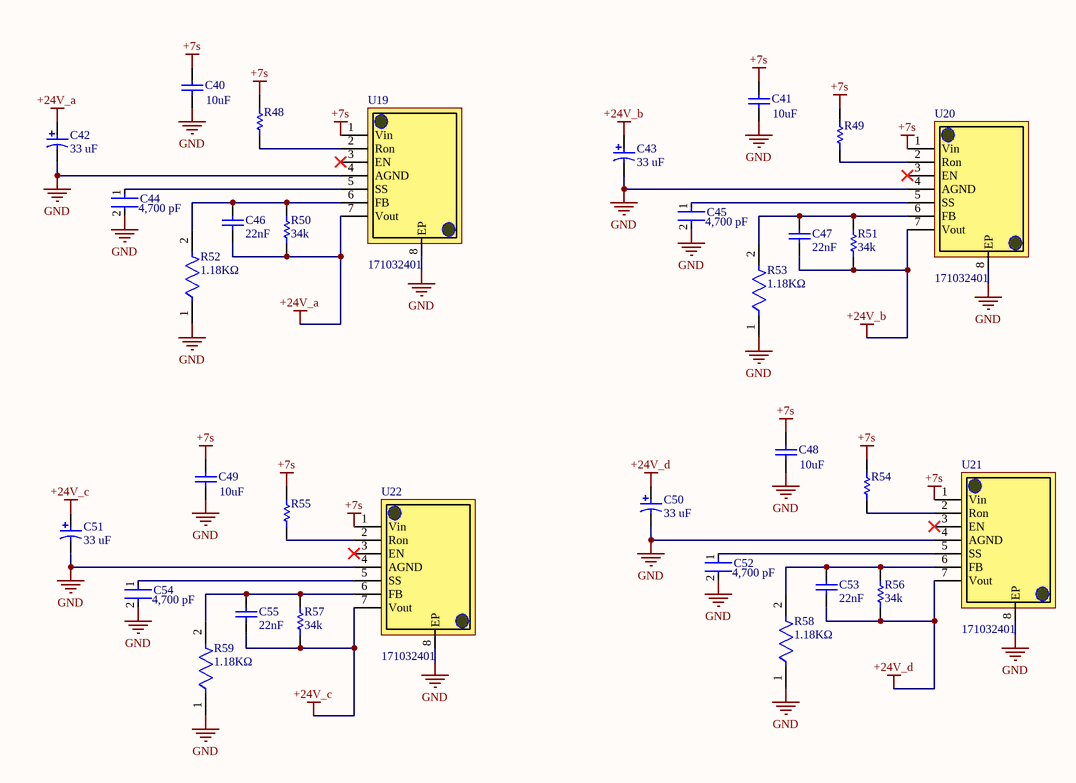
[diagram p7: 24V Regulators.SchDoc]

### Parts
C40  value 10uF  [C1206]  (hidden comment: Cap Semi)
C41  value 10uF  [C1206]  (hidden comment: Cap Semi)
C42  Rated Capacitance: 33 uF  [NIC-CAPA2-6.3X5.8_V]  (hidden comment: UUD1V330MCL1GS)
C43  Rated Capacitance: 33 uF  [NIC-CAPA2-6.3X5.8_V]  (hidden comment: UUD1V330MCL1GS)
C44  Capacitance: 4,700 pF  [FP-C0805C-DN-MFG]  (hidden comment: C0805C472K5RACTU)
C45  Capacitance: 4,700 pF  [FP-C0805C-DN-MFG]  (hidden comment: C0805C472K5RACTU)
C46  22nF  [CAPC2013X145X50NL20T25]
C47  22nF  [CAPC2013X145X50NL20T25]
C48  value 10uF  [C1206]  (hidden comment: Cap Semi)
C49  value 10uF  [C1206]  (hidden comment: Cap Semi)
C50  Rated Capacitance: 33 uF  [NIC-CAPA2-6.3X5.8_V]  (hidden comment: UUD1V330MCL1GS)
C51  Rated Capacitance: 33 uF  [NIC-CAPA2-6.3X5.8_V]  (hidden comment: UUD1V330MCL1GS)
C52  Capacitance: 4,700 pF  [FP-C0805C-DN-MFG]  (hidden comment: C0805C472K5RACTU)
C53  22nF  [CAPC2013X145X50NL20T25]
C54  Capacitance: 4,700 pF  [FP-C0805C-DN-MFG]  (hidden comment: C0805C472K5RACTU)
C55  22nF  [CAPC2013X145X50NL20T25]
R48  RC0805FR-07499KL  [RESC2013X60X35LL10T20]  (value not drawn)
R49  RC0805FR-07499KL  [RESC2013X60X35LL10T20]  (value not drawn)
R50  value 34k  [RESC2013X60X40ML20T25]  (hidden comment: ERA6AEB3402V)
R51  value 34k  [RESC2013X60X40ML20T25]  (hidden comment: ERA6AEB3402V)
R52  value 1.18KΩ  [FP-RT0805-MFG]  (hidden comment: RT0805BRE071K18L)
R53  value 1.18KΩ  [FP-RT0805-MFG]  (hidden comment: RT0805BRE071K18L)
R54  RC0805FR-07499KL  [RESC2013X60X35LL10T20]  (value not drawn)
R55  RC0805FR-07499KL  [RESC2013X60X35LL10T20]  (value not drawn)
R56  value 34k  [RESC2013X60X40ML20T25]  (hidden comment: ERA6AEB3402V)
R57  value 34k  [RESC2013X60X40ML20T25]  (hidden comment: ERA6AEB3402V)
R58  value 1.18KΩ  [FP-RT0805-MFG]  (hidden comment: RT0805BRE071K18L)
R59  value 1.18KΩ  [FP-RT0805-MFG]  (hidden comment: RT0805BRE071K18L)
U19  171032401  [7 PIN PFM]
U20  171032401  [7 PIN PFM]
U21  171032401  [7 PIN PFM]
U22  171032401  [7 PIN PFM]

### Nets
+7s: C40.1 C41.1 C48.1 C49.1 R48.1 R49.1 R54.1 R55.1 U19.1(Vin) U20.1(Vin) U21.1(Vin) U22.1(Vin)
+24V_a: C42.1 C46.1 R50.1 U19.7(Vout)
+24V_b: C43.1 C47.1 R51.1 U20.7(Vout)
+24V_c: C51.1 C55.1 R57.1 U22.7(Vout)
+24V_d: C50.1 C53.1 R56.1 U21.7(Vout)
GND: C40.2 C41.2 C42.2 C43.2 C44.2 C45.2 C48.2 C49.2 C50.2 C51.2 C52.2 C54.2 R52.1 R53.1 R58.1 R59.1 U19.4(AGND) U19.8(EP) U20.4(AGND) U20.8(EP) U21.4(AGND) U21.8(EP) U22.4(AGND) U22.8(EP)  [project net AGND]
NetC44_1: C44.1 U19.5(SS)
NetC45_1: C45.1 U20.5(SS)
NetC46_2: C46.2 R50.2 R52.2 U19.6(FB)
NetC47_2: C47.2 R51.2 R53.2 U20.6(FB)
NetC52_1: C52.1 U21.5(SS)
NetC53_2: C53.2 R56.2 R58.2 U21.6(FB)
NetC54_1: C54.1 U22.5(SS)
NetC55_2: C55.2 R57.2 R59.2 U22.6(FB)
NetR48_2: R48.2 U19.2(Ron)
NetR49_2: R49.2 U20.2(Ron)
NetR54_2: R54.2 U21.2(Ron)
NetR55_2: R55.2 U22.2(Ron)

Not connected (* = marked no-connect by the designer): U19 3(EN)*; U20 3(EN)*; U21 3(EN)*; U22 3(EN)*

### Library data of the parts
C40 C41 C48 C49 = Cap Semi: Capacitor (Semiconductor SIM Model); Published: 8-Jun-2000; LatestRevisionDate: 29-May-2009; LatestRevisionNote: IPC-7351 Footprint Added.; PackageReference: C1206; Publisher: Altium Limited; PackageDescription: Chip Capacitor; Supplier 1: Avnet; Supplier Part Number 1: CL31A106MBHNNNE
C42 C43 C50 C51 = CMP-0687-00044-1: Aluminum Electrolytic Capacitor, UD Series, Low Impedance, 33 uF, 35 V, + / - 20%, -55 to 105 degC, Chip Type, 6.3 x 5.8 mm D x L, Pb-Free, Reel; Manufacturer: Nichicon; Rated Ripple Current (at 100kHz): 230 mA; Endurance Time: 2000 h; Packing: Dia382mm Reel; Tolerance Rated Capacitance: -20 to 20%; Impedance: 0.44 Ohm; Rated Voltage: 35 V; RoHS: TRUE; PackageReference: CAPAE-D6.3H5.8; PartNumber: UUD1V330MCL1GS; ComponentLink3Description: Package Specification; Diameter: 6.3 mm; PackageDescription: 2-Pin Surface Mount Device, Diameter 6.3 mm, Height 5.8 mm, Pitch 5.4 mm; ComponentLink1URL: http://www.nichicon.co.jp/; Length: 5.8 mm; ComponentLink1Description: Manufacturer URL; ComponentLink2URL: http://products.nichicon.co.jp/en/pdf/XJA043/e-ud.pdf; ComponentLink3URL: http://products.nichicon.co.jp/en/pdf/XJA043/e-ud.pdf; ComponentLink2Description: Datasheet; Mounting Technology: Surface Mount; DatasheetVersion: 08/2012
C44 C45 C52 C54 = CMP-03020-025139-1: CAP CER 4700PF 50V X7R 0805; Manufacturer: KEMET; Value: 4,700 pF; Material: Ceramic; Tolerance: 0.1; Temperature Coefficient: 30ppm/°C; Temperature Characteristic: X7R; Manufacturer Part Number: C0805C472K5RACTU; Temperature Range Low: -55°C; Device Class L1: Passive Components; Lead Free: Yes; Category: Cap; ComponentLink2Description: Datasheet; ComponentLink2URL: https://content.kemet.com/datasheets/KEM_C1003_C0G_SMD.pdf; Device Class L3: Ceramic Capacitors; Digikey Description: CAP CER 4700PF 50V X7R 0805; RoHS: TRUE; Temperature Range High: +125°C; Voltage Rating: 50 V; Mouser Description: Cap Ceramic 0.0047uF 50V X7R 10% SMD 0805 125°C Paper T/R; Octopart: https://octopart.com/c0805c472k5ractu-kemet-86501; Automotive: No; Package: C0805C-DN; Height: 0.88mm; Device Class L2: Capacitors; Temperature: -55°C to +125°C; Ipc Land Pattern Name: CAPC200125X78
C46 C47 C53 C55 = CMP-2007-01055-1: Part Number: C0805C223K1RACAUTO; Manufacturer: Kemet
R48 R49 R54 R55 = CMP-2001-01165-1: Manufacturer: Yageo; Part Number: RC0805FR-07499KL
R50 R51 R56 R57 = CMP-2001-00803-1: Manufacturer: Panasonic; Part Number: ERA6AEB3402V
R52 R53 R58 R59 = CMP-03412-010286-1: RES SMD 1.18K OHM 0.1% 1/8W 0805; Manufacturer: Yageo; Temperature Coefficient: 50 ppm/°C; Voltage Rating: 150V; Power Rating: 0.125W; Tolerance: 0.0025; Lead Free: Yes; Manufacturer Part Number: RT0805BRE071K18L; Temperature Range Low: -55°C; Device Class L3: Chip SMD Resistors; RoHS: TRUE; Temperature: -55°C to +155°C; Ipc Land Pattern Name: RESC200125X50; Device Class L2: Resistors; ComponentLink2Description: Datasheet; Automotive: No; Digikey Description: RES SMD 1.18K OHM 0.1% 1/8W 0805; Category: Res; ComponentLink2URL: http://www.yageo.com/documents/recent/PYu-RT_1-to-0.01_RoHS_L_9.pdf; Series: RT; Package: RT0805; Device Class L1: Passive Components; Octopart: https://octopart.com/rt0805bre071k18l-yageo-1175281; Footprint Url: http://www.yageo.com/exep/pages/download/literatures/PYu-R_Mount_10.pdf; Composition: Thin Film; Height: 0.6mm; Resistance: 1.18KΩ; Temperature Range High: +155°C
U19-U22 = CMP-1496-00005-1: MagI³C-VDRM Variable Step Down Regulator Module WE-VDRM , Ui=6-42V; Manufacturer: Wuerth Elektronik; Ui: 6-42 V; ComponentLink1Description: Manufacturer URL; ComponentLink2Description: Datasheet; ComponentLink1URL: http://www.we-online.com; ComponentLink2URL: http://katalog-live.we-online.de/pm/datasheet/171032401.pdf; PartNumber: 171032401; PackageReference: 7 PIN PFM

## Nets that join several sheets
+3.3V_D: MCU (25 pins), CANbus (C3.2), DAQ and Actuators (16 pins), Temp_Sensor (C24.2 R20.2 R21.2 U11.8), Thermocouple (18 pins), Power (C34.1 LED12.2 TP4.1 U16.5)
+5V: MCU (D3.1), CANbus (C1.2 C2.2 U1A.3 U1B.3), DAQ and Actuators (15 pins), Power (8 pins)
+7s: CANbus (8 pins), Power (9 pins), 24V Regulators (12 pins)
+24V_a: DAQ and Actuators (U24.15 U24.18 U24.21), 24V Regulators (C42.1 C46.1 R50.1 U19.7)
+24V_b: DAQ and Actuators (U26.15 U26.18 U26.21), 24V Regulators (C43.1 C47.1 R51.1 U20.7)
+24V_c: DAQ and Actuators (U28.15 U28.18 U28.21), 24V Regulators (C51.1 C55.1 R57.1 U22.7)
+24V_d: DAQ and Actuators (U30.15 U30.18 U30.21), 24V Regulators (C50.1 C53.1 R56.1 U21.7)
AGND: MCU (40 pins), CANbus (21 pins), DAQ and Actuators (80 pins), Temp_Sensor (5 pins), Thermocouple (46 pins), Power (19 pins), 24V Regulators (24 pins)
MISO0: MCU (U4.112), DAQ and Actuators (U24.16 U26.16 U28.16 U30.16)
MISO1: MCU (U4.96), DAQ and Actuators (U23.7 U27.7)
MISO2: MCU (U4.143), DAQ and Actuators (U25.7 U29.7)
MOSI0: MCU (U4.111), DAQ and Actuators (U24.12 U26.12 U28.12 U30.12)
NetJ2_1: MCU (U4.45), CANbus (J2.1 U1A.1)
NetJ2_2: MCU (U4.46), CANbus (J2.2 U1A.4)
NetJ3_1: MCU (U4.64), CANbus (J3.1 U1B.1)
NetJ3_2: MCU (U4.65), CANbus (J3.2 U1B.4)
NetR20_1: MCU (U4.84), Temp_Sensor (R20.1 U11.1)
NetR21_1: MCU (U4.83), Temp_Sensor (R21.1 U11.2)
NetU1A_5: MCU (U4.47), CANbus (U1A.5)
NetU1B_5: MCU (U4.63), CANbus (U1B.5)
NetU4_123: MCU (U4.123), Thermocouple (U15.9)
NetU4_124: MCU (U4.124), Thermocouple (U15.7)
NetU4_125: MCU (U4.125), Thermocouple (U13.9)
NetU4_126: MCU (U4.126), Thermocouple (U13.7)
NetU4_127: MCU (U4.127), Thermocouple (U12.9)
NetU4_128: MCU (U4.128), Thermocouple (U12.7)
NetU4_129: MCU (U4.129), Thermocouple (U14.9)
NetU4_130: MCU (U4.130), Thermocouple (U14.7)
SCK0: MCU (U4.110), DAQ and Actuators (U24.11 U26.11 U28.11 U30.11)
SCK1: MCU (U4.92), DAQ and Actuators (U23.8 U27.8)
SCK2: MCU (U4.141), DAQ and Actuators (U25.8 U29.8)
SCL1: MCU (U4.115), Thermocouple (R65.2 U12.19 U13.19)
SCL3: MCU (U4.14), Thermocouple (R67.2 U14.19 U15.19)
SDA1: MCU (U4.116), Thermocouple (R64.1 U12.20 U13.20)
SDA3: MCU (U4.13), Thermocouple (R66.2 U14.20 U15.20)
SPI0_CS0: MCU (U4.109), DAQ and Actuators (U24.10)
SPI0_CS1: MCU (U4.106), DAQ and Actuators (U26.10)
SPI0_CS2: MCU (U4.105), DAQ and Actuators (U28.10)
SPI0_CS3: MCU (U4.104), DAQ and Actuators (U30.10)
SPI1_CS0: MCU (U4.91), DAQ and Actuators (U23.6)
SPI1_CS1: MCU (U4.90), DAQ and Actuators (U27.6)
SPI2_CS0: MCU (U4.140), DAQ and Actuators (U25.6)
SPI2_CS1: MCU (U4.144), DAQ and Actuators (U29.6)